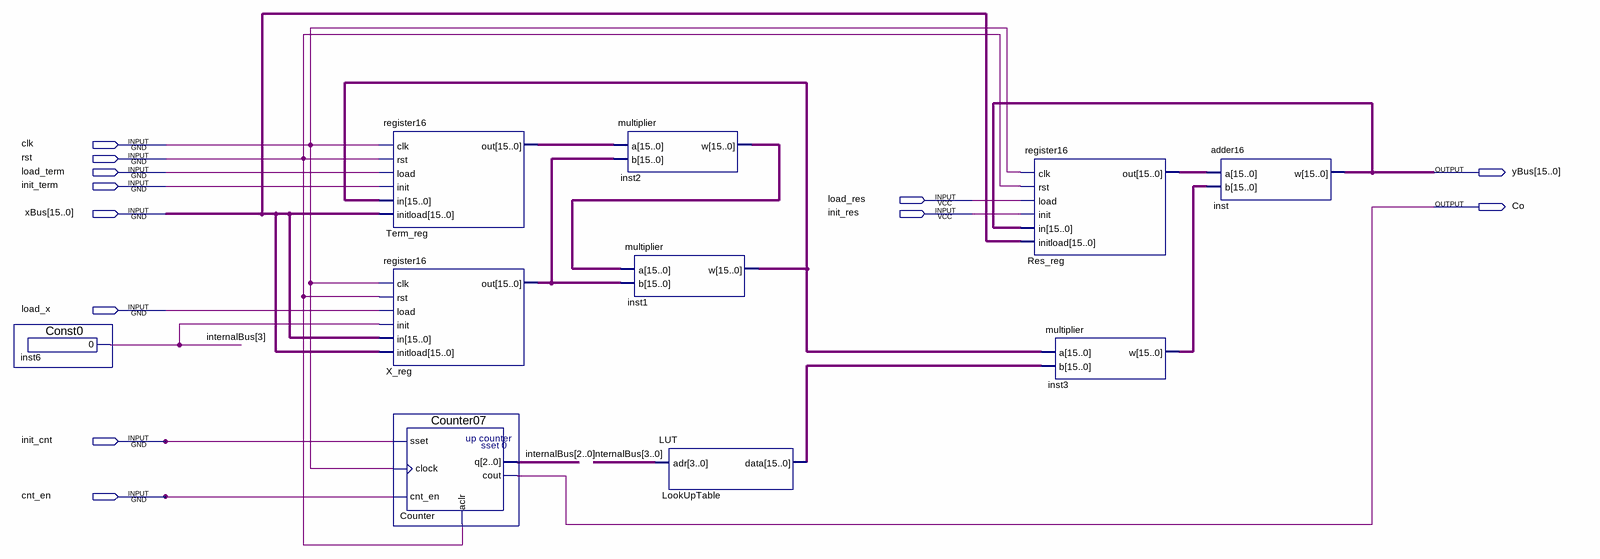
[diagram p0: schematic sheet]
// Quartus schematic DataPath.bdf as structural Verilog: 10 symbols, 12 pins
module DataPath (
  input  clk,
  input  rst,
  input  load_term,
  input  init_term,
  input  load_res,
  input  [15:0] xBus,
  input  init_res,
  input  load_x,
  input  init_cnt,
  input  cnt_en,
  output [15:0] yBus,
  output Co
);

  wire [3:0] internalBus;
  wire [15:0] inst1_w, inst2_w, inst3_w, LookUpTable_data, Res_reg_out, Term_reg_out, X_reg_out;

  Const0 inst6 (.result(internalBus[3]));
  register16 Term_reg (
    .clk(clk), .rst(rst), .load(load_term), .init(init_term), .in(inst1_w), .initload(xBus),
    .out(Term_reg_out));
  register16 X_reg (
    .clk(clk), .rst(rst), .load(load_x), .init(internalBus[3]), .in(xBus), .initload(xBus), .out(X_reg_out));
  Counter07 Counter (.sset(init_cnt), .clock(clk), .cnt_en(cnt_en), .aclr(rst), .cout(Co), .q(internalBus[2:0]));
  multiplier inst2 (.a(Term_reg_out), .b(X_reg_out), .w(inst2_w));
  multiplier inst1 (.a(inst2_w), .b(X_reg_out), .w(inst1_w));
  LUT LookUpTable (.adr(internalBus), .data(LookUpTable_data));
  register16 Res_reg (
    .clk(clk), .rst(rst), .load(load_res), .init(init_res), .in(yBus), .initload(xBus), .out(Res_reg_out));
  multiplier inst3 (.a(inst1_w), .b(LookUpTable_data), .w(inst3_w));
  adder16 inst (.a(Res_reg_out), .b(inst3_w), .w(yBus));
endmodule
